# Altium schematic sheet Sch4MainCardControl.SchDoc: Main Card Control (MCC)
size Letter; Address1: Afshin Kashani Ilkhechi; DocumentNumber: 4; Revision: 2; SheetNumber: 4; SheetTotal: 5
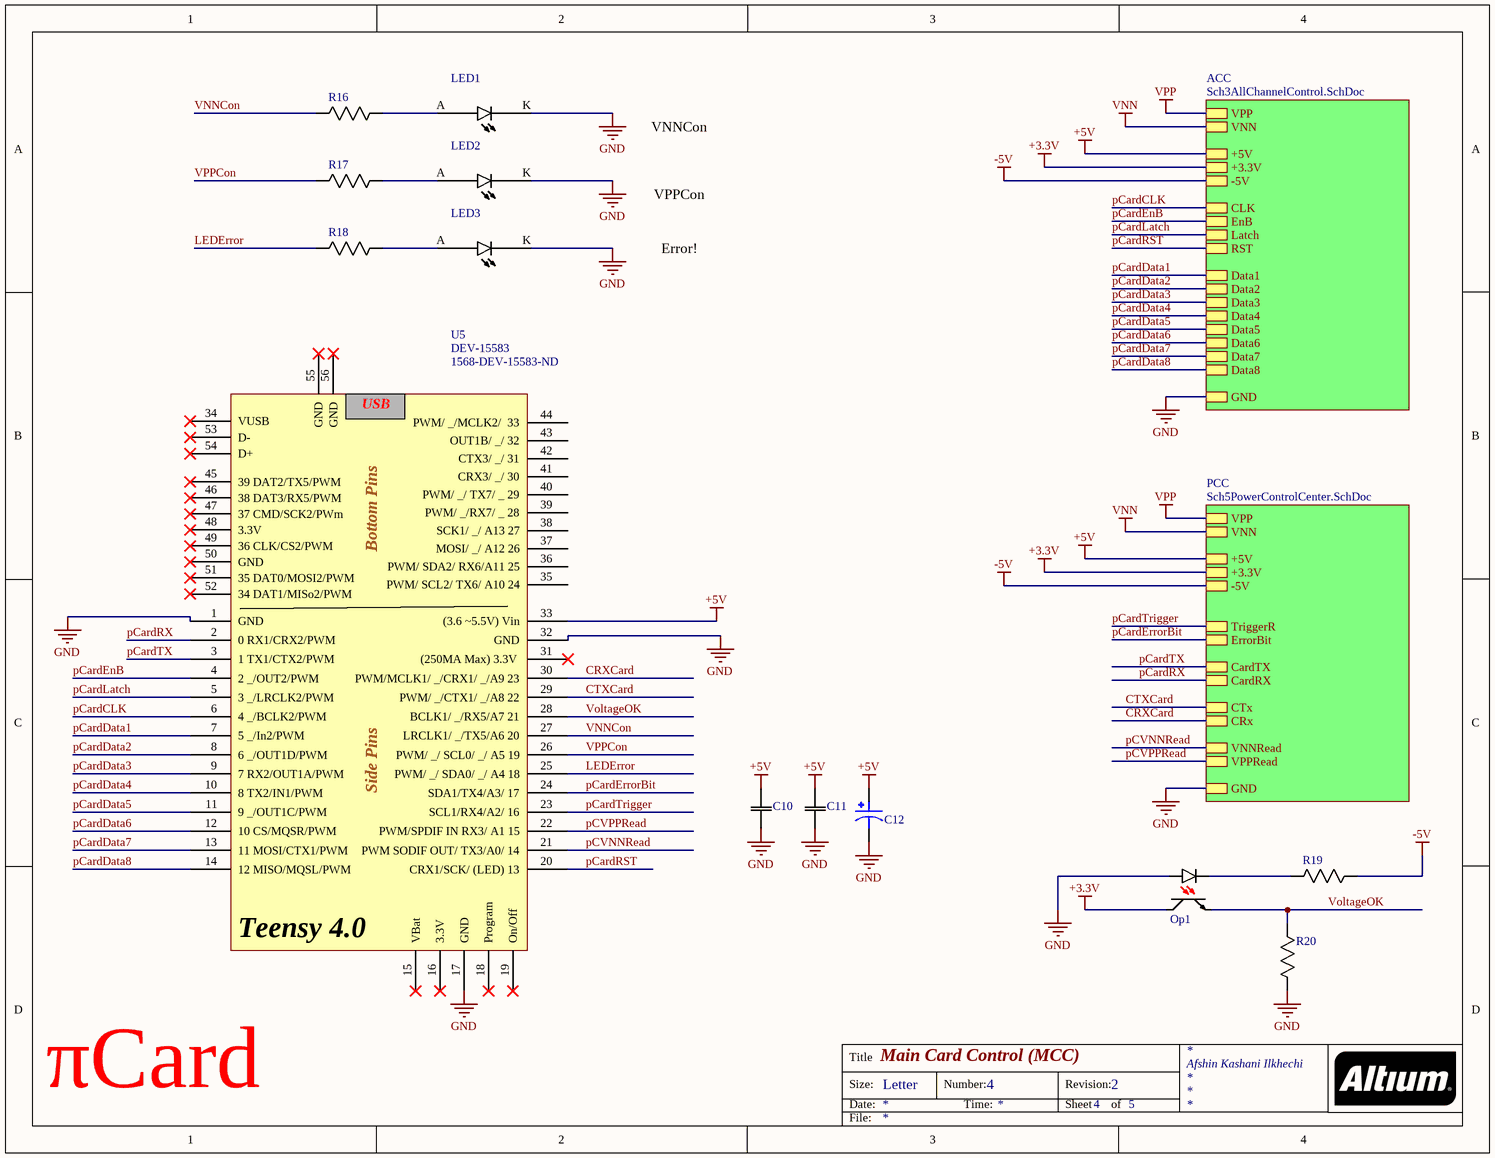
[diagram p0: Sch4MainCardControl.SchDoc]

## Parts
C10  GRM155R71C103MA01D  [C0402]  (value not drawn)
C11  GRM155R71C103MA01D  [C0402]  (value not drawn)
C12  T55A107M6R3C0200  [C1206]  (value not drawn)
LED1  LH R974-LP-1  [LEDr0805]  (value not drawn)
LED2  LH R974-LP-1  [LEDr0805]  (value not drawn)
LED3  LH R974-LP-1  [LEDr0805]  (value not drawn)
Op1  TLP291(GB,SE  [4-SOIC]  (value not drawn)
R16  ERA-2AEB331X  [0402]  (value not drawn)
R17  ERA-2AEB331X  [0402]  (value not drawn)
R18  ERA-2AEB331X  [0402]  (value not drawn)
R19  ERA-2AEB331X  [0402]  (value not drawn)
R20  RK73B1ETTP103J  [R0402]  (value not drawn)
U5  DEV-15583  Supplier Part Number 1: 1568-DEV-15583-ND  [Teensy 4.0sideOnly]

## Sub-sheets
ACC = Sch3AllChannelControl.SchDoc: CLK, EnB, Latch, RST, VPP, VNN, GND, +5V, +3.3V, -5V, Data2, Data3, Data4, Data1, Data6, Data7, Data8, Data5
PCC = Sch5PowerControlCenter.SchDoc: CTx, CRx, +5V, -5V, GND, +3.3V, CardTX, CardRX, TriggerR, ErrorBit, VPP, VNN, VPPRead, VNNRead

## Nets
+3.3V: Op1.4 ; sheet ACC/+3.3V, sheet PCC/+3.3V
+5V: C10.2 C11.2 C12.1(POS) U5.33((3.6_~5.5V)_Vin) ; sheet ACC/+5V, sheet PCC/+5V
-5V: R19.1 ; sheet ACC/-5V, sheet PCC/-5V
GND: C10.1 C11.1 C12.2(NEG) LED1.K(k) LED2.K(k) LED3.K(k) Op1.1 R20.1 U5.1(GND) U5.17(GND) U5.32(GND) ; sheet ACC/GND, sheet PCC/GND
VNN: sheet ACC/VNN, sheet PCC/VNN
VPP: sheet ACC/VPP, sheet PCC/VPP
CRXCard: U5.30(PWM/MCLK1/__/CRX1/__/A9_23) ; sheet PCC/CRx
CTXCard: U5.29(PWM/__/CTX1/__/A8_22) ; sheet PCC/CTx
LEDError: R18.2 U5.25(PWM/__/_SDA0/__/_A4_18)
pCardCLK: U5.6(4__/BCLK2/PWM) ; sheet ACC/CLK
pCardData1: U5.7(5__/In2/PWM) ; sheet ACC/Data1
pCardData2: U5.8(6__/OUT1D/PWM) ; sheet ACC/Data2
pCardData3: U5.9(7_RX2/OUT1A/PWM) ; sheet ACC/Data3
pCardData4: U5.10(8_TX2/IN1/PWM) ; sheet ACC/Data4
pCardData5: U5.11(9__/OUT1C/PWM) ; sheet ACC/Data5
pCardData6: U5.12(10_CS/MQSR/PWM) ; sheet ACC/Data6
pCardData7: U5.13(11_MOSI/CTX1/PWM) ; sheet ACC/Data7
pCardData8: U5.14(12_MISO/MQSL/PWM) ; sheet ACC/Data8
pCardEnB: U5.4(2__/OUT2/PWM) ; sheet ACC/EnB
pCardErrorBit: U5.24(SDA1/TX4/A3/_17) ; sheet PCC/ErrorBit
pCardLatch: U5.5(3__/LRCLK2/PWM) ; sheet ACC/Latch
pCardRST: U5.20(CRX1/SCK/_(LED)_13) ; sheet ACC/RST
pCardRX: U5.2(0_RX1/CRX2/PWM) ; sheet PCC/CardRX
pCardTrigger: U5.23(SCL1/RX4/A2/_16) ; sheet PCC/TriggerR
pCardTX: U5.3(1_TX1/CTX2/PWM) ; sheet PCC/CardTX
pCVNNRead: U5.21(PWM_SODIF_OUT/_TX3/A0/_14) ; sheet PCC/VNNRead
pCVPPRead: U5.22(PWM/SPDIF_IN_RX3/_A1_15) ; sheet PCC/VPPRead
VNNCon: R16.2 U5.27(LRCLK1/__/TX5/A6_20)
VoltageOK: Op1.3 R20.2 U5.28(BCLK1/__/RX5/A7_21)
VPPCon: R17.2 U5.26(PWM/__/_SCL0/__/_A5_19)
NetLED1_A: LED1.A R16.1
NetLED2_A: LED2.A R17.1
NetLED3_A: LED3.A R18.1
NetOp1_2: Op1.2 R19.2

Not connected (* = marked no-connect by the designer): U5 15(VBat)* 16(3.3V)* 18(Program)* 19(On/Off)* 31((250MA_Max)_3.3V_)* 34(VUSB)* 35(PWM/_SCL2/_TX6/_A10_24) 36(PWM/_SDA2/_RX6/A11_25) 37(MOSI/__/_A12_26) 38(SCK1/__/_A13_27) 39(PWM/__/RX7/___28) 40(PWM/__/_TX7/___29) 41(CRX3/__/_30) 42(CTX3/__/_31) 43(OUT1B/__/_32) 44(PWM/__/MCLK2/__33) 45(39_DAT2/TX5/PWM)* 46(38_DAT3/RX5/PWM)* 47(37_CMD/SCK2/PWm)* 48(3.3V)* 49(36_CLK/CS2/PWM)* 50(GND)* 51(35_DAT0/MOSI2/PWM)* 52(34_DAT1/MISo2/PWM)* 53(D-)* 54(D+)* 55(GND)* 56(GND)*

## Notes on the sheet
- VNNCon
- VPPCon
- Error!
- πCard
- Title
- Size:
- Date:
- Letter
- Number:
- Time:
- Revision:
- Sheet
- of
- File:
- (in symbol Teensy 4.0) USB; Bottom Pins; Side Pins

## Library data of the parts
C10 C11 = Cap_0402: Supplier 1: Digi-Key; Supplier Part Number 1: 490-16353-1-ND
C12 = Cap_1206: Tantalium; Supplier 1: Mouser; Supplier Part Number 1: 74-T55A107M6R3C0200
LED1-LED3 = LED_0805: LED: / LH R974-LP-1 / LG R971-KN-1 / LY R976-PS-36; Supplier 1: Digi-Key; Supplier Part Number 1: 475-1415-1-ND
Op1 = TLP291: Supplier 1: Digi-Key; Supplier Part Number 1: TLP291(GBSE-ND
R16-R19 = Res_0805: Supplier 1: Digi-Key; Supplier Part Number 1: P330DCCT-ND
R20 = Res_0402: Supplier 1: Digi-Key; Supplier Part Number 1: 2019-RK73B1ETTP103JCT-ND
U5 = Teensy 4.0: Supplier 1: Digi-Key